# Altium schematic sheet esquematico.SchDoc: Filtro
size A4; Date: 1/11; Address1: Yapeyú; Address2: Almagro; Address3: CABA; Address4: Argentina; DocumentNumber: .; Revision: 1.0; SheetNumber: 1; SheetTotal: 1
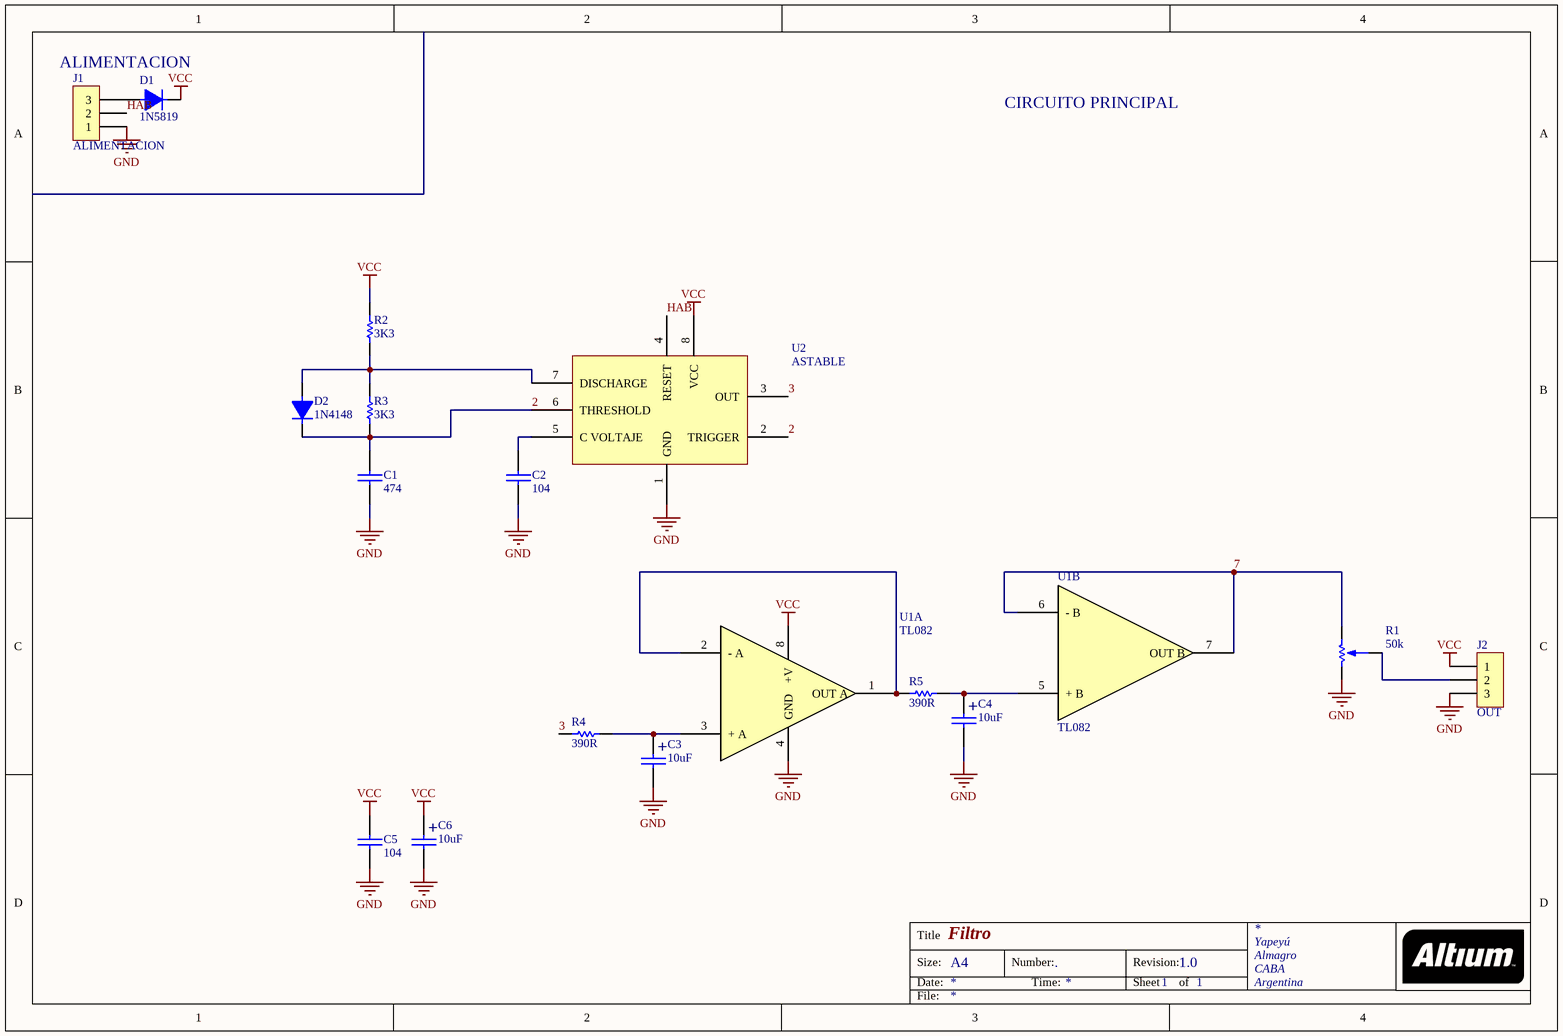
[diagram p0: esquematico.SchDoc]

## Parts
C1  474  [CAP100]
C2  104  [CAP100]
C3  10uF  [CAP100RP]
C4  10uF  [CAP100RP]
C5  104  [CAP100]
C6  10uF  [CAP100RP]
D1  1N5819  [DO41]
D2  1N4148  [DO41]
J1  ALIMENTACION  [BORNERA3]
J2  OUT  [BORNERA3]
R1  50k  [SIP3]
R2  3K3  [RES400]
R3  3K3  [RES400]
R4  390R  [RES400]
R5  390R  [RES400]
U1  TL082  [DIP8]  (parts A,B of 2)
U2  ASTABLE  [DIP8]

## Nets
GND: C1.2 C2.2 C3.2 C4.2 C5.2 C6.2 J1.1 J2.3 R1.1 U1.4(GND) U2.1(GND)
VCC: C5.1 C6.1 D1.2 J2.1 R2.2 U1.8(+V) U2.8(VCC)
2: C1.1 D2.2 R3.1 U2.2(TRIGGER) U2.6(THRESHOLD)
3: R4.2 U2.3(OUT)
7: R1.3 U1.6(-_B) U1.7(OUT_B)
HAB: J1.2 U2.4(RESET)
NetC2_1: C2.1 U2.5(C_VOLTAJE)
NetC3_1: C3.1 R4.1 U1.3(+_A)
NetC4_1: C4.1 R5.1 U1.5(+_B)
NetD1_1: D1.1 J1.3
NetD2_1: D2.1 R2.1 R3.2 U2.7(DISCHARGE)
NetJ2_2: J2.2 R1.2
NetR5_2: R5.2 U1.1(OUT_A) U1.2(-_A)

## Notes on the sheet
- ALIMENTACION
- CIRCUITO PRINCIPAL
- Title
- Size:
- Date:
- A4
- Number:
- Time:
- Revision:
- Sheet
- of
- File:
- (in symbol CAPPOL) +

## Library data of the parts
C1 C2 C5 = CAP
C3 C4 C6 = CAPPOL
D1 D2 = DIODO
J1 J2 = BORNERA 3
R1 = POTENCIOMETRO
R2-R5 = RES
U2 = LM555: Timer